# EAGLE schematic safety_assistant_sch (EAGLE 6.6.0)
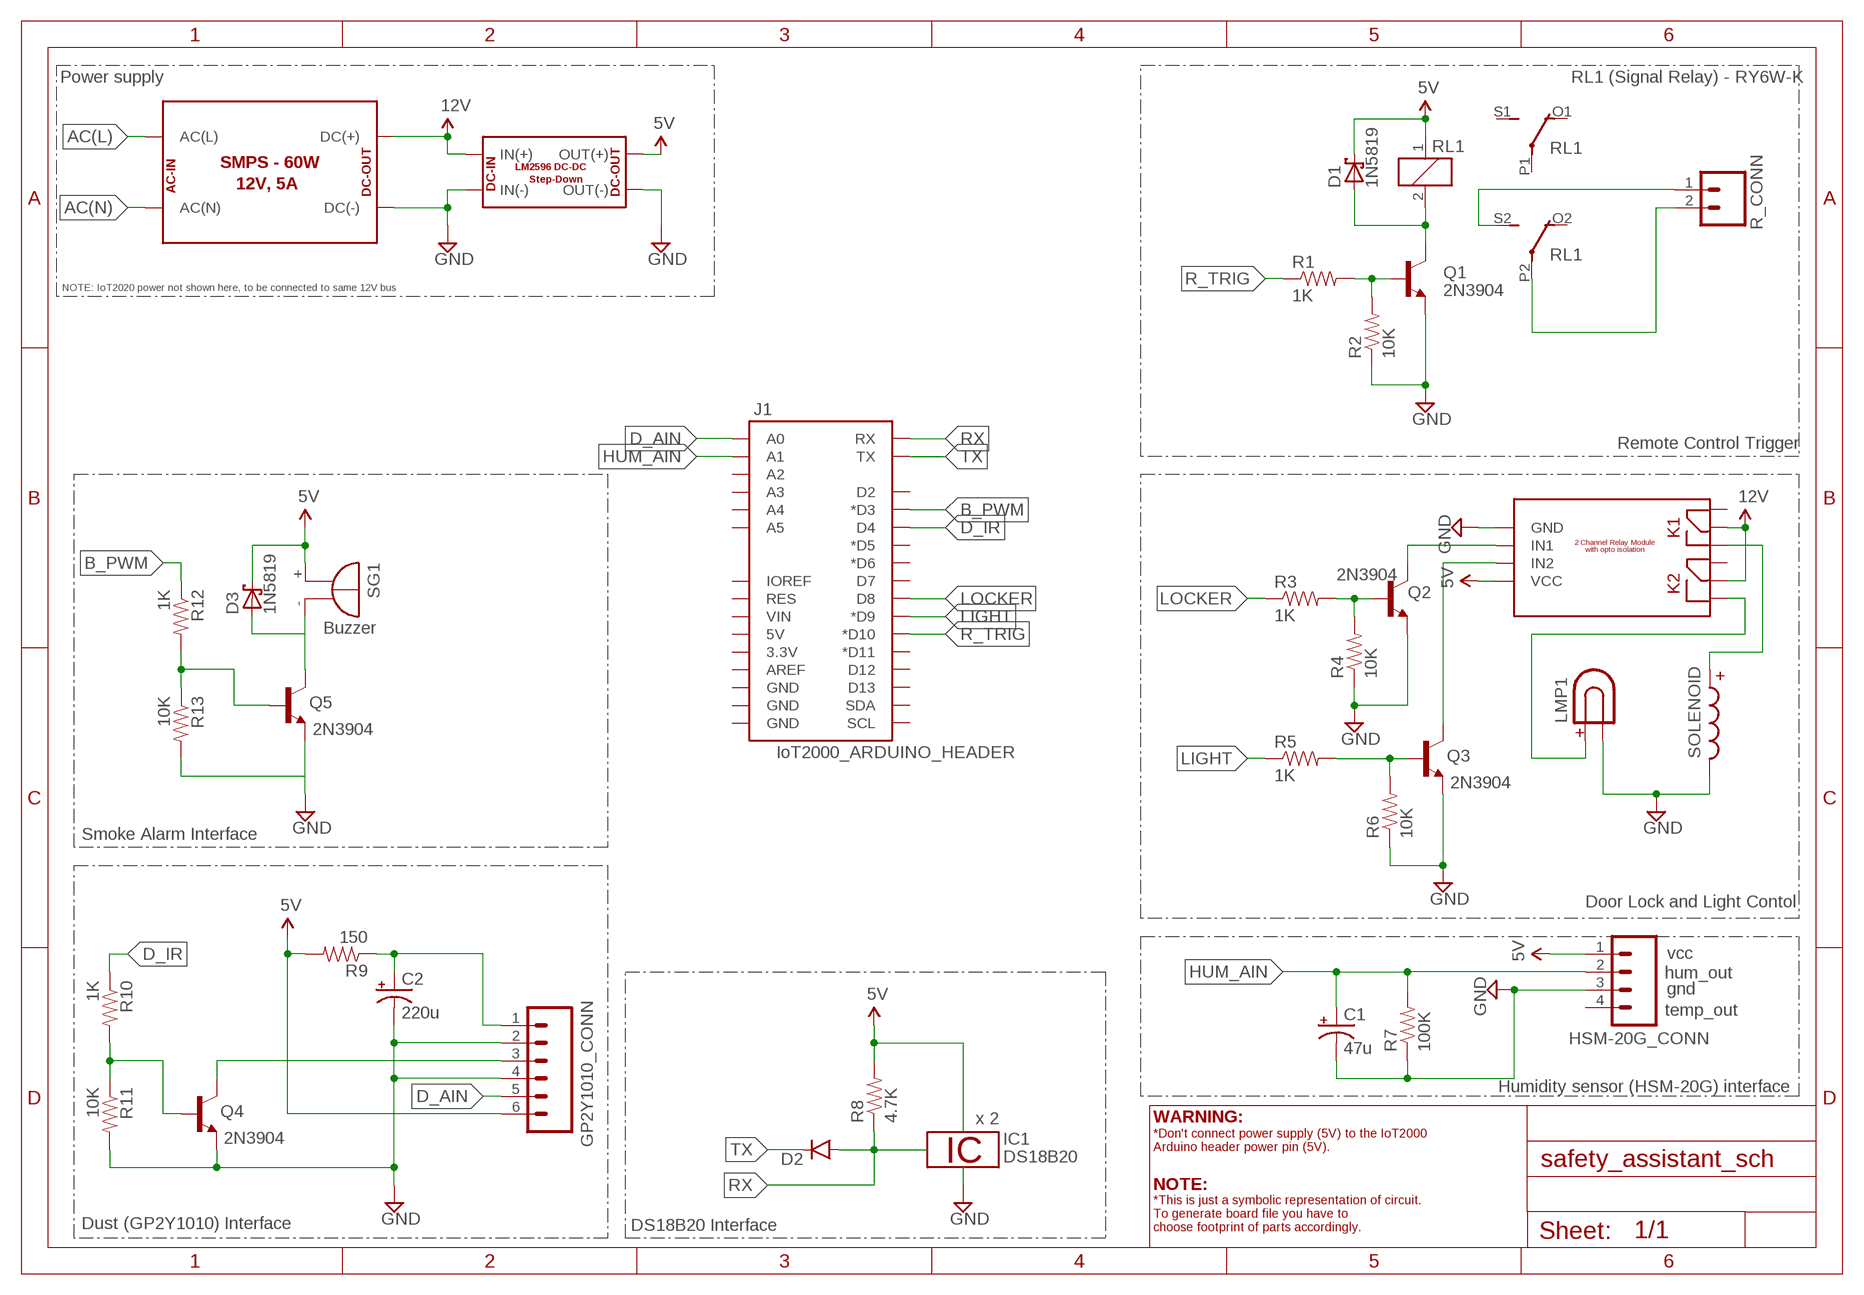
[diagram p0: schematic, sheet 1]

## Parts
C1  47u  CAP_POLPTH1  [CPOL-RADIAL-100UF-25V]
C2  220u  CAP_POLPTH1  [CPOL-RADIAL-100UF-25V]
D1  1N5819  1N5819-B  [DO41-7.6]
D2  DIODE1N4148  [DIODE-1N4148]
D3  1N5819  1N5819-B  [DO41-7.6]
GP2Y1010_CONN  M06SILK_FEMALE_PTH  [1X06]
HSM-20G_CONN  M04POLAR  [MOLEX-1X4]
IC1  DS18B20  DS18S20  [TO92-]
J1  IoT2000_ARDUINO_HEADER  ARDUINO_R3_SHIELD  [UNO_R3_SHIELD]
LMP1  LAMP  [LDH-5R]
Q1  2N3904  TRANSISTOR_NPNBC547  [TO-92-AMMO]
Q2  2N3904  [TO92]
Q3  2N3904  [TO92]
Q4  2N3904  [TO92]
Q5  2N3904  [TO92]
R1  1K  RESISTORAXIAL-0.3  [AXIAL-0.3]
R2  10K  RESISTORAXIAL-0.3  [AXIAL-0.3]
R3  1K  RESISTORAXIAL-0.3  [AXIAL-0.3]
R4  10K  RESISTORAXIAL-0.3  [AXIAL-0.3]
R5  1K  RESISTORAXIAL-0.3  [AXIAL-0.3]
R6  10K  RESISTORAXIAL-0.3  [AXIAL-0.3]
R7  100K  RESISTORAXIAL-0.3  [AXIAL-0.3]
R8  4.7K  RESISTORAXIAL-0.3  [AXIAL-0.3]
R9  150  RESISTORAXIAL-0.3  [AXIAL-0.3]
R10  1K  RESISTORAXIAL-0.3  [AXIAL-0.3]
R11  10K  RESISTORAXIAL-0.3  [AXIAL-0.3]
R12  1K  RESISTORAXIAL-0.3  [AXIAL-0.3]
R13  10K  RESISTORAXIAL-0.3  [AXIAL-0.3]
R_CONN  M02PTH  [1X02]
RL1  RY6W-R  G2R2  [G2R2]
SG1  Buzzer  EB2505  [EB2505]
SOLENOID  L-US0204/7  [0204/7]
U$1  RELAY_MODULE  [RELAY_MODULE]
U$2  LM2596_M  [LM2596_M]
U$3  SMPS_60W  [SMPS_60W]

## Nets
5V: D1.C D3.C GP2Y1010_CONN.6 HSM-20G_CONN.1 R8.P$2 R9.P$2 RL1.1 SG1.+ U$1.P$10(VCC) U$2.P$3(OUT(+))
12V: U$1.P$5 U$1.P$8 U$2.P$1(IN(+)) U$3.P$3(DC(+))
AC(L): U$3.P$1(AC(L))
AC(N): U$3.P$2(AC(N))
B_PWM: J1.D3(*D3) R12.P$1
D_AIN: GP2Y1010_CONN.5 J1.A0
D_IR: J1.D4 R10.P$1
GND: C1.2(-) C2.2(-) GP2Y1010_CONN.2 GP2Y1010_CONN.4 HSM-20G_CONN.3 LMP1.2 Q1.3(E) Q2.3(E) Q3.3(E) Q4.3(E) Q5.3(E) R2.P$1 R4.P$1 R6.P$1 R7.P$1 R11.P$2 R13.P$2 SOLENOID.2 U$1.P$1(GND) U$2.P$2(IN(-)) U$2.P$4(OUT(-)) U$3.P$4(DC(-))
HUM_AIN: C1.1(+) HSM-20G_CONN.2 J1.A1 R7.P$2
LIGHT: J1.D9(*D9) R5.P$1
LOCKER: J1.D8 R3.P$1
N$1: Q1.2(B) R1.P$2 R2.P$2
N$2: R_CONN.2 RL1.P2(3:P)
N$3: D1.A Q1.1(C) RL1.2
N$4: R_CONN.1 RL1.S2(3:S)
N$5: Q2.1(C) U$1.P$2(IN1)
N$6: Q3.1(C) U$1.P$3(IN2)
N$7: Q2.2(B) R3.P$2 R4.P$2
N$8: Q3.2(B) R5.P$2 R6.P$2
N$9: LMP1.1 U$1.P$9
N$10: SOLENOID.1 U$1.P$6
N$11: C2.1(+) GP2Y1010_CONN.1 R9.P$1
N$12: GP2Y1010_CONN.3 Q4.1(C)
N$13: D3.A Q5.1(C) SG1.-
N$14: Q5.2(B) R12.P$2 R13.P$1
N$15: Q4.2(B) R10.P$2 R11.P$1
R_TRIG: J1.D10(*D10) R1.P$1
RX: D2.A J1.RX R8.P$1
TX: D2.C J1.TX
Unconnected: HSM-20G_CONN.4 J1.3.3V J1.5V J1.A2 J1.A3 J1.A4 J1.A5 J1.AREF J1.D2 J1.D5(*D5) J1.D6(*D6) J1.D7 J1.D11(*D11) J1.D12 J1.D13 J1.GND@0(GND) J1.GND@1(GND) J1.GND@2(GND) J1.IOREF J1.RES J1.SCL J1.SDA J1.VIN RL1.O1(2:O) RL1.O2(3:O) RL1.P1(2:P) RL1.S1(2:S)

## Notes on the sheet
- Power supply | RL1 (Signal Relay) - RY6W-K
- NOTE: IoT2020 power not shown here, to be connected to same 12V bus
- Remote Control Trigger
- +
- +
- Smoke Alarm Interface
- Door Lock and Light Contol
- vcc
- hum_out
- gnd
- temp_out
- Humidity sensor (HSM-20G) interface
- x 2 | WARNING:
- *Don't connect power supply (5V) to the IoT2000
  Arduino header power pin (5V).
- NOTE:
- Dust (GP2Y1010) Interface | DS18B20 Interface
- *This is just a symbolic representation of circuit. 
  To generate board file you have to
  choose footprint of parts accordingly.

## Power pins joined to a net without a drawn wire
1W: IC1.2
GND: IC1.1
P$5: U$1.P$4
P$8: U$1.P$7
VDD: IC1.3

## Library data of the parts
C1 C2 = SparkFun-Capacitors:CAP_POL: Capacitor Polarized These are standard SMD and PTH capacitors. Normally 10uF, 47uF, and 100uF in electrolytic and tantalum varieties. Always verify the external diameter of the through hole cap, it varies with capacity, voltage, and manufacturer. The EIA devices should be standard.
D1 D3 = diode:1N581*: 1.0A SCHOTTKY BARRIER RECTIFIER Source: http://www.diodes.com/datasheets/ds23001.pdf
D2 = SparkFun-DiscreteSemi:DIODE: Diode These are standard reverse protection diodes and small signal diodes. SMA package can handle up to about 1A. SOD-323 can handle about 200mA. What the SOD-323 package when ordering, there are some mfgs out there that are 5-pin packages.
GP2Y1010_CONN = SparkFun-Connectors:M06: Header 6 Standard 6-pin 0.1" header. Use with straight break away headers (SKU : PRT-00116), right angle break away headers (PRT-00553), swiss pins (PRT-00743), machine pins (PRT-00117), and female headers (PRT-00115). Molex polarized connector foot print use with SKU : PRT-08094 with associated crimp pins and housings. NOTES ON THE VARIANTS LOCK and LOCK_LONGPADS... This footprint was designed to help hold the alignment of a through-hole component (i.e. 6-pin header) while soldering it into place. You may notice that each hole has been shifted either up or down by 0.005 of an inch from it's more standard position (which is a perfectly straight line). This slight alteration caused the pins (the squares in the middle) to touch the edges of the holes. Because they are alternating, it causes a "brace" to hold the component in place. 0.005 has proven to be the perfect amount of "off-center" position when using our standard breakaway headers. Although looks a little odd when you look at the bare footprint, once you have a header in there, the alteration is very hard to notice. Also,if you push a header all the way into place, it is covered up entirely on the bottom side. This idea of altering the position of holes to aid alignment will be further integrated into the Sparkfun Library for other footprints. It can help hold any component with 3 or more connection pins.; PROD_ID: CONN-08437
HSM-20G_CONN = SparkFun-Connectors:M04: Header 4 Standard 4-pin 0.1" header. Use with straight break away headers (SKU : PRT-00116), right angle break away headers (PRT-00553), swiss pins (PRT-00743), machine pins (PRT-00117), and female headers (PRT-00115). Molex polarized connector foot print use with SKU : PRT-08231 with associated crimp pins and housings. 1MM SMD Version SKU: PRT-10208
IC1 = 1wire:DS18S20: High Precision Digital Thermometer This chip provides a onewire thermosensor with approx. 0.5°C accuracy.A programmable over/undertemperure alarm is available. Notes: Vdd must be applied for accurate measurements at low temperatures, as the parasite power circuit otherwise heats the sensor. If parasite power is used, Vdd has to be connected to GND. The DS1822 is a low-cost thermometer chip, the DS18B20 is similar to the DS18S20, but with 9..12 Bit programmable precision. Author: Jan Kandziora <jjj@gmx.de>
J1 = SparkFun-Boards:ARDUINO_R3_SHIELD: Shield form compatible with the Arduino Uno R3.
LMP1 = special:LAMP: LED HOLDER
Q1 = SparkFun-DiscreteSemi:TRANSISTOR_NPN: Generic NPN BJT MMBT2222A - TRANS-08049 (SOT-23, 1A 40V) MPSA42 - TRANS-09116 (SOT-23, 500mA 300V) MMBT5088LT1G - TRANS-11160 (SOT-23, 50 mA 30V) BC547 - COM-08928 <http://www.sparkfun.com/products/8928> (TO-92 45V 100mA) (1.Collector 2.Base 3.Emitter) 2N3904 - COM-00521 <http://www.sparkfun.com/products/521> (TO-92 40V 200mA) (1.Emitter 2.Base 3.Collector) P2N2222A - COM-12852 <http://www.sparkfun.com/products/12852> (TO-92 40V 600mA) (1.Collector 2.Base 3.Emitter)
Q2-Q5 = transistor:2N3904: NPN TRANSISTOR
R1-R13 = SparkFun-Passives:RESISTOR: Resistor Basic schematic elements and footprints for 0603, 1206, and PTH resistors.
R_CONN = SparkFun-Connectors:M02: Standard 2-pin 0.1" header. Use with - straight break away headers ( PRT-00116) - right angle break away headers (PRT-00553) - swiss pins (PRT-00743) - machine pins (PRT-00117) - female headers (PRT-00115) Molex polarized connector foot print use with: PRT-08233 with associated crimp pins and housings. 2.54_SCREWTERM for use with PRT-10571. 3.5mm Screw Terminal footprints for PRT-08084 5mm Screw Terminal footprints for use with PRT-08432
RL1 = relay:G2R2: RELAY 2 x switch, Omron; MF: OMRON COMPONENTS USA; MPN: G2R-2-DC6; OC_FARNELL: unknown; OC_NEWARK: 89C5317
SG1 = buzzer:EB2505: BUZZER Source: Buerklin; OC_FARNELL: unknown; OC_NEWARK: unknown
SOLENOID = rcl:L-US: INDUCTOR, American symbol
U$1 = relay_module_ch02:RELAY_MODULE
U$2 = lm2596_module:LM2596_M
U$3 = smps_60w:SMPS_60W